# Altium schematic sheet 02_MEMS.SchDoc
size A2; SheetNumber: 3; SheetTotal: 5
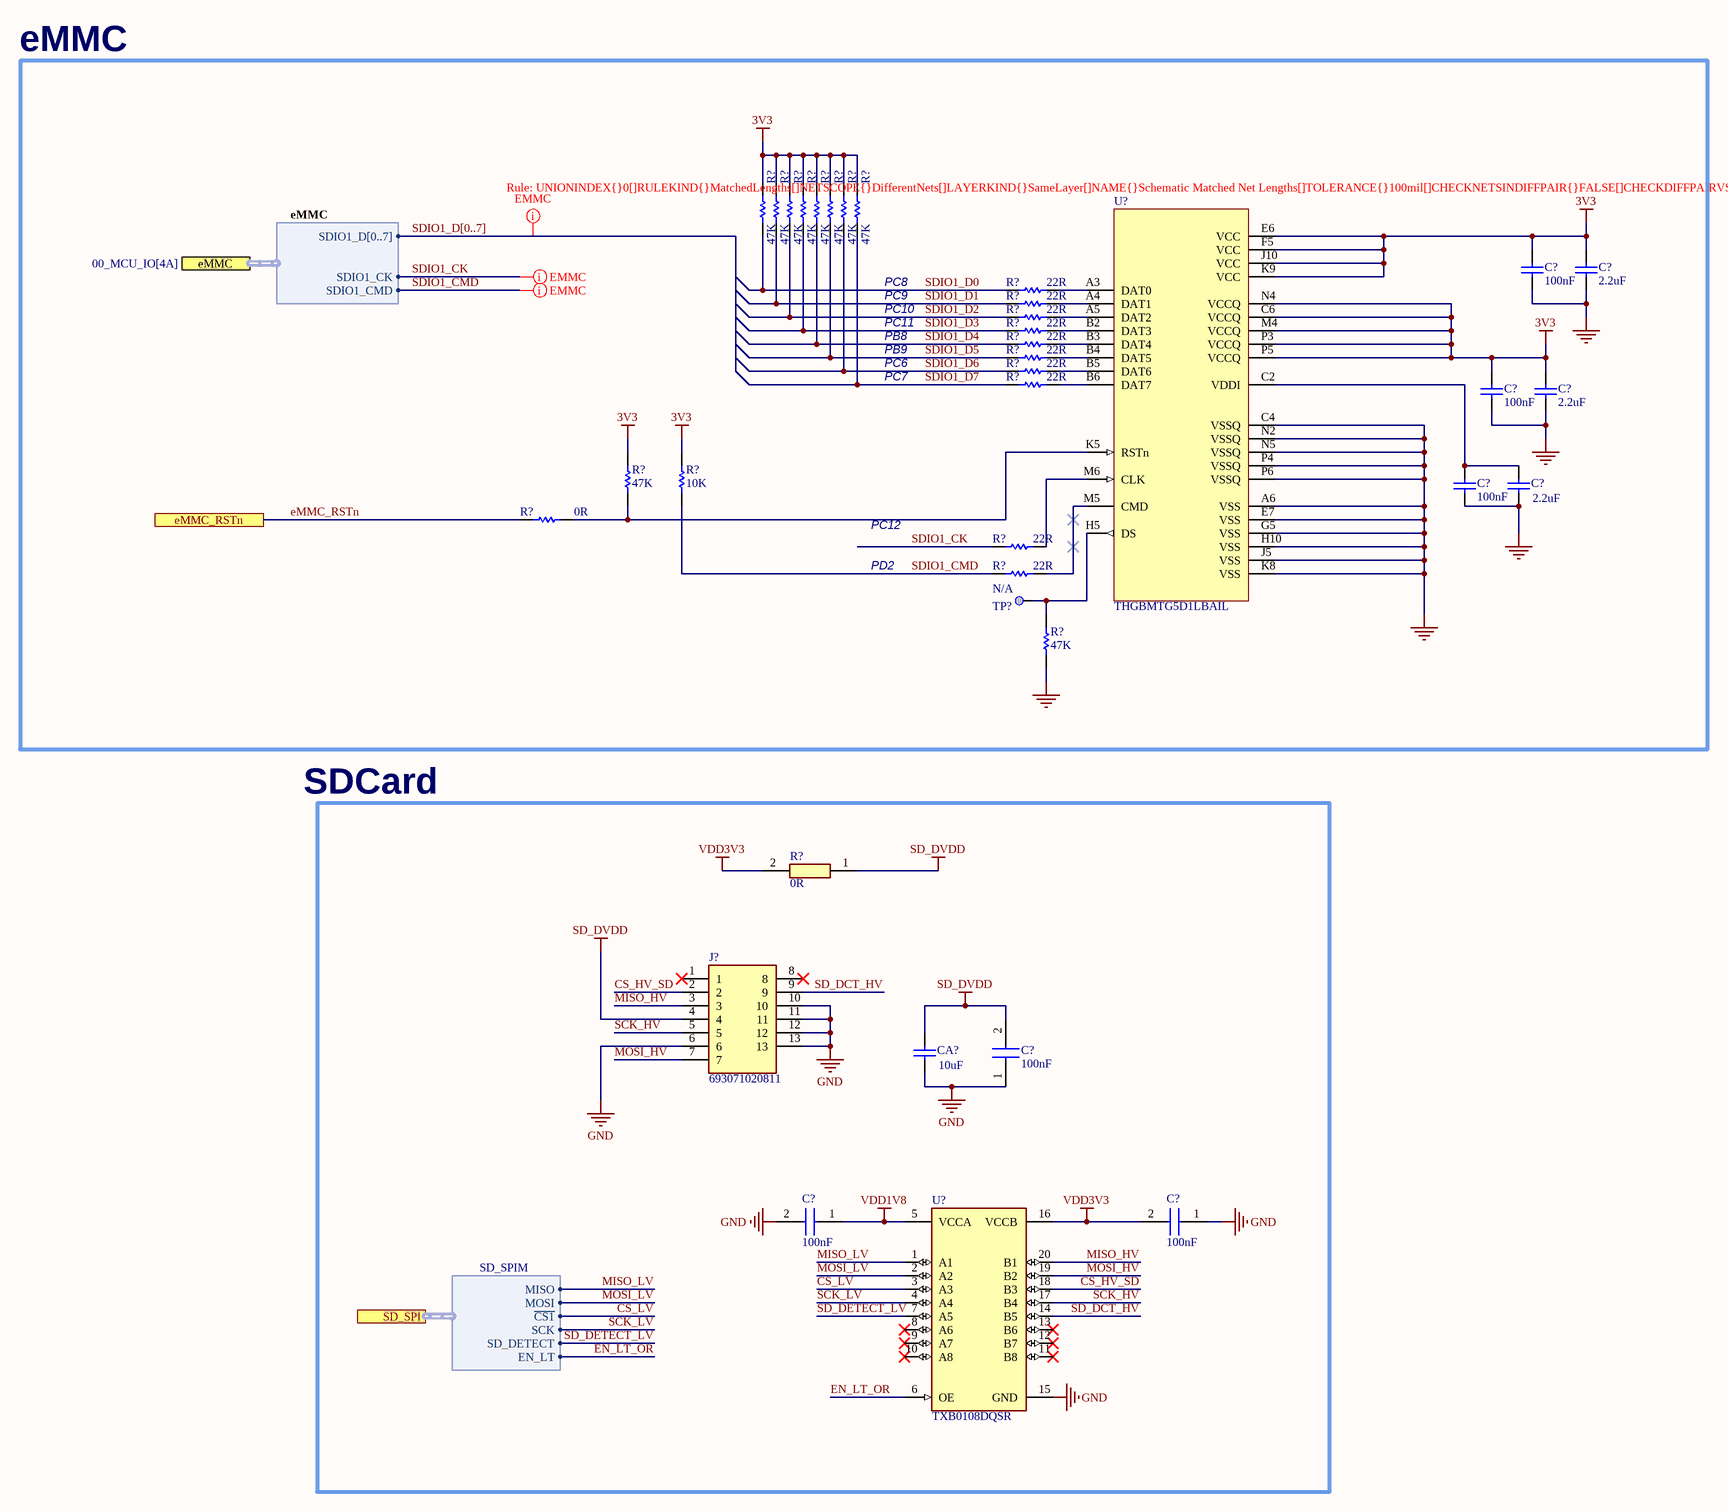
[diagram p0: 02_MEMS.SchDoc]

## Parts
(Parts that share a designator on the sheet are numbered #1, #2 ... from top to bottom, then left to right.)
C?#1  value 100nF  [C0402]  (hidden comment: Capacitor)
C?#2  value 2.2uF  [C0603]  (hidden comment: Capacitor)
C?#3  value 100nF  [C0402]  (hidden comment: Capacitor)
C?#4  value 2.2uF  [C0603]  (hidden comment: Capacitor)
C?#5  value 100nF  [C0402]
C?#6  value 2.2uF  [C0603]
C?#7  value 100nF  [GCM033C70J104KE02D]  (hidden comment: GCM033C71A104KE02J)
C?#8  value 100nF  [GCM033C70J104KE02D]  (hidden comment: GCM033C71A104KE02J)
C?#9  value 100nF  [GCM033C70J104KE02D]  (hidden comment: GCM033C71A104KE02J)
CA?  10uF  [0402]
J?  693071020811  [693071020811]
R?#1  value 47K  [R0402]  (hidden comment: Resistor)
R?#2  value 47K  [R0402]  (hidden comment: Resistor)
R?#3  value 47K  [R0402]  (hidden comment: Resistor)
R?#4  value 47K  [R0402]  (hidden comment: Resistor)
R?#5  value 47K  [R0402]  (hidden comment: Resistor)
R?#6  value 47K  [R0402]  (hidden comment: Resistor)
R?#7  value 47K  [R0402]  (hidden comment: Resistor)
R?#8  value 47K  [R0402]  (hidden comment: Resistor)
R?#9  value 22R  [R0402]  (hidden comment: Resistor)
R?#10  value 22R  [R0402]  (hidden comment: Resistor)
R?#11  value 22R  [R0402]  (hidden comment: Resistor)
R?#12  value 22R  [R0402]  (hidden comment: Resistor)
R?#13  value 22R  [R0402]  (hidden comment: Resistor)
R?#14  value 22R  [R0402]  (hidden comment: Resistor)
R?#15  value 22R  [R0402]  (hidden comment: Resistor)
R?#16  value 22R  [R0402]  (hidden comment: Resistor)
R?#17  value 47K  [R0402]  (hidden comment: Resistor)
R?#18  value 10K  [R0402]  (hidden comment: Resistor)
R?#19  value 0R  [R0402]  (hidden comment: N/A)
R?#20  value 22R  [R0402]  (hidden comment: Resistor)
R?#21  value 22R  [R0402]  (hidden comment: Resistor)
R?#22  value 47K  [R0402]  (hidden comment: Resistor)
R?#23  value 0R  [RESC1005X40N]  (hidden comment: ERJ-S020R00X)
TP?  Test Point  [TP_SMD_0-3MM]  (value not drawn)  (no BOM)
U?#1  value THGBMTG5D1LBAIL  [ICC_P-WFBGA153_13X11P5_P050]  (hidden comment: eMMC_THGBMTG5D1LBAIL)
U?#2  TXB0108DQSR  [FP-DQS0020A-MFG]

## Blocks framed on the sheet
eMMC: C?#1-C?#6 R?#1-R?#22 TP? U?#1
SDCard: C?#7-C?#9 CA? J? R?#23 U?#2

## Ports
eMMC (harness eMMC, see 00_MCU_IO[4A]), eMMC_RSTn, SD_SPI (harness SD_SPIM)

## Harnesses
eMMC: SDIO1_D[0..7], SDIO1_CMD, SDIO1_CK
SD_SPIM: SCK, ~{CS1}, MOSI, MISO, SD_DETECT, EN_LT

## Nets
3V3: C?#1.2 C?#2.2 C?#3.2 C?#4.2 R?#1.2 R?#2.2 R?#3.2 R?#4.2 R?#5.2 R?#6.2 R?#7.2 R?#8.2 R?#17.2 R?#18.2 U?#1.C6(VCCQ) U?#1.E6(VCC) U?#1.F5(VCC) U?#1.J10(VCC) U?#1.K9(VCC) U?#1.M4(VCCQ) U?#1.N4(VCCQ) U?#1.P3(VCCQ) U?#1.P5(VCCQ)
GND: C?#1.1 C?#2.1 C?#3.1 C?#4.1 C?#5.1 C?#6.1 C?#7.1 C?#8.2 C?#9.1 CA?.1 J?.6 J?.10 J?.11 J?.12 J?.13 R?#22.2 U?#1.A6(VSS) U?#1.C4(VSSQ) U?#1.E7(VSS) U?#1.G5(VSS) U?#1.H10(VSS) U?#1.J5(VSS) U?#1.K8(VSS) U?#1.N2(VSSQ) U?#1.N5(VSSQ) U?#1.P4(VSSQ) U?#1.P6(VSSQ) U?#2.15(GND)
SD_DVDD: C?#7.2 CA?.2 J?.4 R?#23.1
VDD1V8: C?#8.1 U?#2.5(VCCA)
VDD3V3: C?#9.2 R?#23.2 U?#2.16(VCCB)
CS_HV_SD: J?.2 U?#2.18(B3)
CS_LV: U?#2.3(A3) ; port SD_SPI.~{CS1}
eMMC_RSTn: R?#19.1 ; port eMMC_RSTn
EN_LT_OR: U?#2.6(OE) ; port SD_SPI.EN_LT
MISO_HV: J?.3 U?#2.20(B1)
MISO_LV: U?#2.1(A1) ; port SD_SPI.MISO
MOSI_HV: J?.7 U?#2.19(B2)
MOSI_LV: U?#2.2(A2) ; port SD_SPI.MOSI
SCK_HV: J?.5 U?#2.17(B4)
SCK_LV: U?#2.4(A4) ; port SD_SPI.SCK
SD_DCT_HV: J?.9 U?#2.14(B5)
SD_DETECT_LV: U?#2.7(A5) ; port SD_SPI.SD_DETECT
SDIO1_CK: R?#20.1 ; port eMMC.SDIO1_CK
SDIO1_CMD: R?#18.1 R?#21.1 ; port eMMC.SDIO1_CMD
SDIO1_D0: R?#1.1 R?#9.1
SDIO1_D1: R?#2.1 R?#10.1
SDIO1_D2: R?#3.1 R?#11.1
SDIO1_D3: R?#4.1 R?#12.1
SDIO1_D4: R?#5.1 R?#13.1
SDIO1_D5: R?#6.1 R?#14.1
SDIO1_D6: R?#7.1 R?#15.1
SDIO1_D7: R?#8.1 R?#16.1
NetC?#5_2: C?#5.2 C?#6.2 U?#1.C2(VDDI)
NetR?#9_2: R?#9.2 U?#1.A3(DAT0)
NetR?#10_2: R?#10.2 U?#1.A4(DAT1)
NetR?#11_2: R?#11.2 U?#1.A5(DAT2)
NetR?#12_2: R?#12.2 U?#1.B2(DAT3)
NetR?#13_2: R?#13.2 U?#1.B3(DAT4)
NetR?#14_2: R?#14.2 U?#1.B4(DAT5)
NetR?#15_2: R?#15.2 U?#1.B5(DAT6)
NetR?#16_2: R?#16.2 U?#1.B6(DAT7)
NetR?#17_1: R?#17.1 R?#19.2 U?#1.K5(RSTn)
NetR?#20_2: R?#20.2 U?#1.M6(CLK)
NetR?#21_2: R?#21.2 U?#1.M5(CMD)
NetR?#22_1: R?#22.1 TP?.1 U?#1.H5(DS)

Not connected (* = marked no-connect by the designer): J? 1* 8*; U?#2 8(A6)* 9(A7)* 10(A8)* 11(B8)* 12(B7)* 13(B6)*

## Buses and harness runs
bus SDIO1_D[0..7]

## Layout directives
rule Matched Net Lengths [Tolerance = 100mil]: (no net found under the mark), SDIO1_CK, SDIO1_CMD

## Notes on the sheet
- PC8
- PC9
- PC10
- PC11
- PB8
- PC6
- PC7
- PB9
- PC12
- PD2

## Library data of the parts
C?#1 C?#3 C?#5 = MCD-00006: Capacitor, MLCC, 100nF, 16V, X7R, +/-10%, 0402, T=0.5mm; Manufacturer_Part_Number: CC0402KRX7R7BB104; Manufacturer: YAGEO; Part_Preference: Recommended; Partial_Alternate_Internal_Part_Number: MCD-03299; Component_Country_Of_Origin: China; ID: 2474; Order_Code_RS: 9402047; ShowFields: YES; Internal_Part_Number: MCD-00006; Status: Released; Part_Type: Capacitor; Package: 0402; ComponentLink1URL: http://tunmcdsvn.tun.st.com/Component_Documentation_Library/Trunk/Capacitor/YAGEO_X7R_Series; Order_Code_Digikey: 311-1338-1-ND; Order_Code_Farnell: 9402047
C?#2 C?#4 C?#6 = MCD-00012: Capacitor, MLCC, 2.2uF, 10V, X5R, 10%, 0603, T=0,8mm; Manufacturer_Part_Number: CC0603KRX5R6BB225; Manufacturer: YAGEO; Alternate_Manufacturer_Part_Number: C0603C225K8PACTU; Alternate_Manufacturer: KEMET; BMS_Part_Number: 9142010; Part_Preference: Recommended; Partial_Alternate_Internal_Part_Number: MCD-00551; Provided_By: Subcon; Initial_Board_Reference: MB1274; Component_Country_Of_Origin: China; ID: 2467; Order_Code_RS: 2370679; ShowFields: YES; Internal_Part_Number: MCD-00012; Status: Released; Part_Type: Capacitor; Package: 0603; ComponentLink1Description: Yageo_Capacitor_X5R-series.pdf; ComponentLink1URL: http://tunmcdsvn.tun.st.com/Component_Documentation_Library/Trunk/Capacitor/YAGEO_X5R_Series; ECCN_US: n/a; ECCN_EU: n/a; Order_Code_Digikey: 311-1451-1-ND; Order_Code_Farnell: 2370679
C?#7-C?#9 = GCM033C71A104KE02J: Capacitor; Manufacturer_Name: Murata Electronics; Datasheet Link: https://search.murata.co.jp/Ceramy/image/img/A01X/G101/ENG/GCM033C71A104KE02-01A.pdf; Height: 0.33mm; Manufacturer_Part_Number: GCM033C71A104KE02J
CA? = Cap Semi: Capacitor (Semiconductor SIM Model); Published: 8-Jun-2000; LatestRevisionDate: 29-May-2009; LatestRevisionNote: IPC-7351 Footprint Added.; PackageReference: C1206; Publisher: Altium Limited; PackageDescription: Chip Capacitor; Value: 10uF
J? = 693071020811: Connector; Manufacturer_Name: Wurth Elektronik; Datasheet Link: https://katalog.we-online.com/em/datasheet/693071020811.pdf; Height: 1.85mm; Manufacturer_Part_Number: 693071020811
R?#1-R?#8 R?#17 R?#22 = MCD-00063: Resistor,47K,0402,1%,1/16W; Manufacturer_Part_Number: RC0402FR-0747KL; Manufacturer: YAGEO; Part_Preference: Recommended; Provided_By: Subcon; Initial_Board_Reference: MB1274; Component_Country_Of_Origin: China; ID: 2528; Order_Code_RS: 9239430; ShowFields: YES; Internal_Part_Number: MCD-00063; Status: Released; Part_Type: Resistor; Package: 0402; ComponentLink1Description: Yageo_Resistor_RC0402-series.pdf; ComponentLink1URL: http://tunmcdsvn.tun.st.com/Component_Documentation_Library/Trunk/Resistor/YAGEO_RC_L_Series; ECCN_US: n/a; ECCN_EU: n/a; Order_Code_Digikey: 311-47.0KLRCT-ND; Order_Code_Farnell: 9239430
R?#9-R?#16 R?#20 R?#21 = MCD-00189: Resistor,22R,0402,1%,1/16W; Manufacturer_Part_Number: RC0402FR-0722RL; Manufacturer: YAGEO; Part_Preference: Recommended; Provided_By: Subcon; Component_Country_Of_Origin: China; ID: 2677; ShowFields: YES; Internal_Part_Number: MCD-00189; Status: Released; Part_Type: Resistor; Package: 0402; ComponentLink1Description: Yageo_Resistor_RC0402-series.pdf; ComponentLink1URL: http://tunmcdsvn.tun.st.com/Component_Documentation_Library/Trunk/Resistor/YAGEO_RC_L_Series; ECCN_US: n/a; ECCN_EU: n/a; Order_Code_Digikey: 311-22.0LRCT-ND; Order_Code_Farnell: 9239030; Order_Code_RS: N/A
R?#18 = MCD-00053: Resistor,10K,0402,1%,1/16W; Manufacturer_Part_Number: RC0402FR-0710KL; Manufacturer: YAGEO; BMS_Part_Number: 9131590; Part_Preference: Recommended; Provided_By: subcon; Initial_Board_Reference: MB1274; Component_Country_Of_Origin: China; ID: 2539; Order_Code_RS: 9239359; ShowFields: YES; Internal_Part_Number: MCD-00053; Status: Released; Part_Type: Resistor; Package: 0402; ComponentLink1Description: Yageo_Resistor_RC0402-series.pdf; ComponentLink1URL: http://tunmcdsvn.tun.st.com/Component_Documentation_Library/Trunk/Resistor/YAGEO_RC_L_Series; ECCN_US: n/a; ECCN_EU: n/a; Order_Code_Digikey: 311-10.0KLRCT-ND; Order_Code_Farnell: 9239359
R?#19 = MCD-00052: Resistor,0R,0402,5%,1/16W; Manufacturer_Part_Number: RC0402JR-070RL; Manufacturer: YAGEO; Part_Preference: Recommended; Provided_By: Subcon; Initial_Board_Reference: MB1274; Component_Country_Of_Origin: China; ID: 2540; Order_Code_RS: 9232516RL; ShowFields: YES; Internal_Part_Number: MCD-00052; Status: Released; Part_Type: Resistor; Package: 0402; ComponentLink1Description: Yageo_Resistor_RC0402-series.pdf; ComponentLink1URL: http://tunmcdsvn.tun.st.com/Component_Documentation_Library/Trunk/Resistor/YAGEO_RC_L_Series; ECCN_US: n/a; ECCN_EU: n/a; Order_Code_Digikey: 311-0.0JRCT-ND; Order_Code_Farnell: 9232516RL
R?#23 = ERJ-S020R00X: Resistor; Manufacturer_Name: Panasonic; Datasheet Link: https://industrial.panasonic.com/cdbs/www-data/pdf/RDP0000/AOA0000C334.pdf; Height: 0.4mm; Manufacturer_Part_Number: ERJ-S020R00X; Mouser Part Number: 667-ERJ-S020R00X; Mouser Price/Stock: https://www.mouser.co.uk/ProductDetail/Panasonic/ERJ-S020R00X?qs=Zyl8A9hlmJqcGEcH0dtAYQ%3D%3D; Arrow Part Number: ERJ-S020R00X; Arrow Price/Stock: https://www.arrow.com/en/products/erj-s020r00x/panasonic?region=nac
TP? = MCD-00630: Test Point 0.3mm; Part_Type: Misc; Part_Preference: Recommended; Initial_Board_Reference: MB1264; ID: 3115; ShowFields: YES; Component_Country_Of_Origin: Unknown; Internal_Part_Number: MCD-00630; Status: Released; ECCN_US: n/a; ECCN_EU: n/a; Provided_By: n/a; Manufacturer: N/A; Manufacturer_Part_Number: N/A; Order_Code_Digikey: N/A; Order_Code_Farnell: N/A; Order_Code_RS: N/A; Value: N/A; ComponentLink1URL: http://tunmcdsvn.tun.st.com/Component_Documentation_Library/Trunk; Manufacturer_HQ_COO: Unknown
U?#1 = MCD-02799: Memory, eMMC, 3V3, 4Gbit, 52MHz; Part_Type: IC; Part_Preference: Not recommended; Manufacturer: KIOXIA; Component_Country_Of_Origin: Unknown; ShowFields: YES; ID: 4911; Internal_Part_Number: MCD-02799; Status: Released; Manufacturer_Part_Number: THGBMTG5D1LBAIL; Package: WFBGA153; ComponentLink1URL: http://tunmcdsvn.tun.st.com/Component_Documentation_Library/Trunk/IC/KIOXIA_THGBMTG5D1LBAIL; Order_Code_Digikey: N/A; Order_Code_Farnell: N/A; Order_Code_RS: N/A
U?#2 = CMP-04899-000009-1: IC TRNSLTR BIDIRECTIONAL 20USON; Manufacturer: Texas Instruments; Nominal Supply Current: 0.05-3.5uA; Propagation Delay: 4ns; Max Supply Voltage: 5.5V; V A Min: 1.2V; Max Junction Temp: +150°C; Logic Function Desc: Non-Inverting; Number Of Inputs: 1; V A Max: 3.6V; Number Of Circuits: 8; V B Min: 1.65V; Standoff Height: 0mm; Data Rate: 100Mbits/s; Automotive: No; Mouser Description: Translation - Voltage Levels 8B Bidir Vltg-Level Translator; Category: IC; Temperature Range Low: -40°C; Package: DQS0020A; Manufacturer Part Number: TXB0108DQSR; ComponentLink2Description: Datasheet; Device Class L3: Voltage Level Shifters; Device Class L2: Logic ICs; Temperature Range High: +85°C; Digikey Description: IC TRNSLTR BIDIRECTIONAL 20USON; Octopart: https://octopart.com/txb0108dqsr-texas+instruments-18562890; RoHS: TRUE; Ambient Temperature Range High: +85°C; Lead Free: Yes; V B Max: 5.5V; ComponentLink2URL: https://www.ti.com/lit/ds/symlink/txb0108.pdf; Height: 0.55mm; Ambient Temperature Range Low: -40°C; Temperature: -40°C to +85°C; Number Of Outputs: 1; Min Supply Voltage: 1.2V; Device Class L1: Integrated Circuits (ICs)